# Altium schematic sheet Relay_Control.SchDoc
size A; SheetNumber: 4; SheetTotal: 10
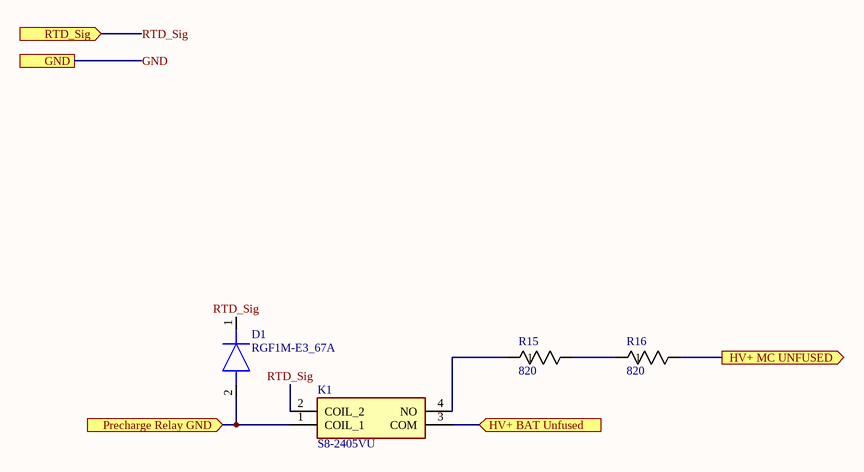
[diagram p0: Relay_Control.SchDoc]

## Parts
D1  RGF1M-E3_67A  [DIOM5426X300N]
K1  S8-2405VU  [S82405VU]
R15  820  [RES_TWM10_OHM]
R16  820  [RES_TWM10_OHM]

## Ports
GND, HV+ BAT Unfused (in), HV+ MC UNFUSED (out), Precharge Relay GND (in), RTD_Sig (in)

## Nets
GND: port GND
HV+ BAT Unfused: K1.3(COM) ; port HV+ BAT Unfused
HV+ MC UNFUSED: R16.2 ; port HV+ MC UNFUSED
Precharge Relay GND: D1.2(A) K1.1(COIL_1) ; port Precharge Relay GND
RTD_Sig: D1.1(K) K1.2(COIL_2) ; port RTD_Sig
NetK1_4: K1.4(NO) R15.1
NetR15_2: R15.2 R16.1

## Library data of the parts
D1 = RGF1M-E3_67A: Diode; Manufacturer_Name: Vishay; Manufacturer_Part_Number: RGF1M-E3/67A; Datasheet Link: https://www.vishay.com/docs/88697/rgf1.pdf; Height: 3mm; Mouser Part Number: 625-RGF1M-E3; Mouser Price/Stock: https://www.mouser.co.uk/ProductDetail/Vishay-General-Semiconductor/RGF1M-E3-67A?qs=4xyK702%2F%252BQ1dl%252BTCdyIThg%3D%3D; Arrow Part Number: RGF1M-E3/67A; Arrow Price/Stock: https://www.arrow.com/en/products/rgf1m-e367a/vishay?region=nac
K1 = S8-2405VU: Relay or Contactor; Manufacturer_Name: Sensata; Datasheet Link: https://componentsearchengine.com/Datasheets/2/S8-2405VU.pdf; Height: 12mm; Manufacturer_Part_Number: S8-2405VU; Mouser Part Number: 285-S8-2405VU; Mouser Price/Stock: https://www.mouser.co.uk/ProductDetail/Cynergy3/S8-2405VU?qs=OlC7AqGiEDkSZm1DfbwcWw%3D%3D
R15 R16 = TWW10J820E: No Description Available; Manufacturer_Name: Ohmite; Copyright: Copyright (C) 2025 Ultra Librarian. All rights reserved.; Manufacturer_Part_Number: TWW10J820E